# Altium schematic sheet BarLed.SchDoc
size A4
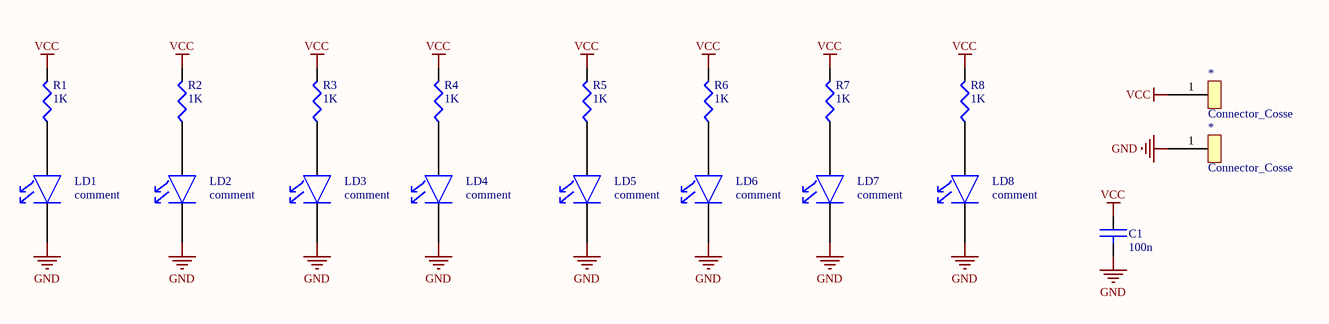
[diagram p0: BarLed.SchDoc]

## Parts
(Parts that share a designator on the sheet are numbered #1, #2 ... from top to bottom, then left to right.)
*#1  Connector_Cosse  [Connector_Cosse]
*#2  Connector_Cosse  [Connector_Cosse]
C1  value 100n  [0805]  (hidden comment: CAP)
LD1  comment  [LED1206]
LD2  comment  [LED1206]
LD3  comment  [LED1206]
LD4  comment  [LED1206]
LD5  comment  [LED1206]
LD6  comment  [LED1206]
LD7  comment  [LED1206]
LD8  comment  [LED1206]
R1  value 1K  [0805]  (hidden comment: RES)
R2  value 1K  [0805]  (hidden comment: RES)
R3  value 1K  [0805]  (hidden comment: RES)
R4  value 1K  [0805]  (hidden comment: RES)
R5  value 1K  [0805]  (hidden comment: RES)
R6  value 1K  [0805]  (hidden comment: RES)
R7  value 1K  [0805]  (hidden comment: RES)
R8  value 1K  [0805]  (hidden comment: RES)

## Nets
GND: *#2.1 C1.2 LD1.K LD2.K LD3.K LD4.K LD5.K LD6.K LD7.K LD8.K
VCC: *#1.1 C1.1 R1.2 R2.2 R3.2 R4.2 R5.2 R6.2 R7.2 R8.2
NetLD1_A: LD1.A R1.1
NetLD2_A: LD2.A R2.1
NetLD3_A: LD3.A R3.1
NetLD4_A: LD4.A R4.1
NetLD5_A: LD5.A R5.1
NetLD6_A: LD6.A R6.1
NetLD7_A: LD7.A R7.1
NetLD8_A: LD8.A R8.1

## Library data of the parts
C1 = CAP: capacité non polarisée
LD1-LD8 = LED: LED 5mm/3mm/CMS
R1-R8 = RES: resistance